# Altium schematic sheet MC2.SchDoc: XEM7360 Breakout Board - MC2
size C; Author: Nick Kettman; Organization: Opal Kelly; Address1: 13500 SW 72nd Ave Ste 100; Address2: Portland, OR 97223; Address4: http://www.opalkelly.com; DocumentNumber: xxx; Revision: 1; SheetNumber: 3; SheetTotal: 3; PageSetup: Record=PageOptions|CenterHorizontal=True|CenterVertical=True|PrintScale=0.53|XCorrection=1.00|YCorrection=1.00|PrintKind=0|BorderSize=5000000|LeftOffset=0|BottomOffset=0|Orientation=2|PaperLength=1000|PaperWidth=1000|Scale=100|PaperSource=7|PrintQuality=-4|MediaType=1|DitherType=10|PaperKind=Letter|PrintScaleMode=1
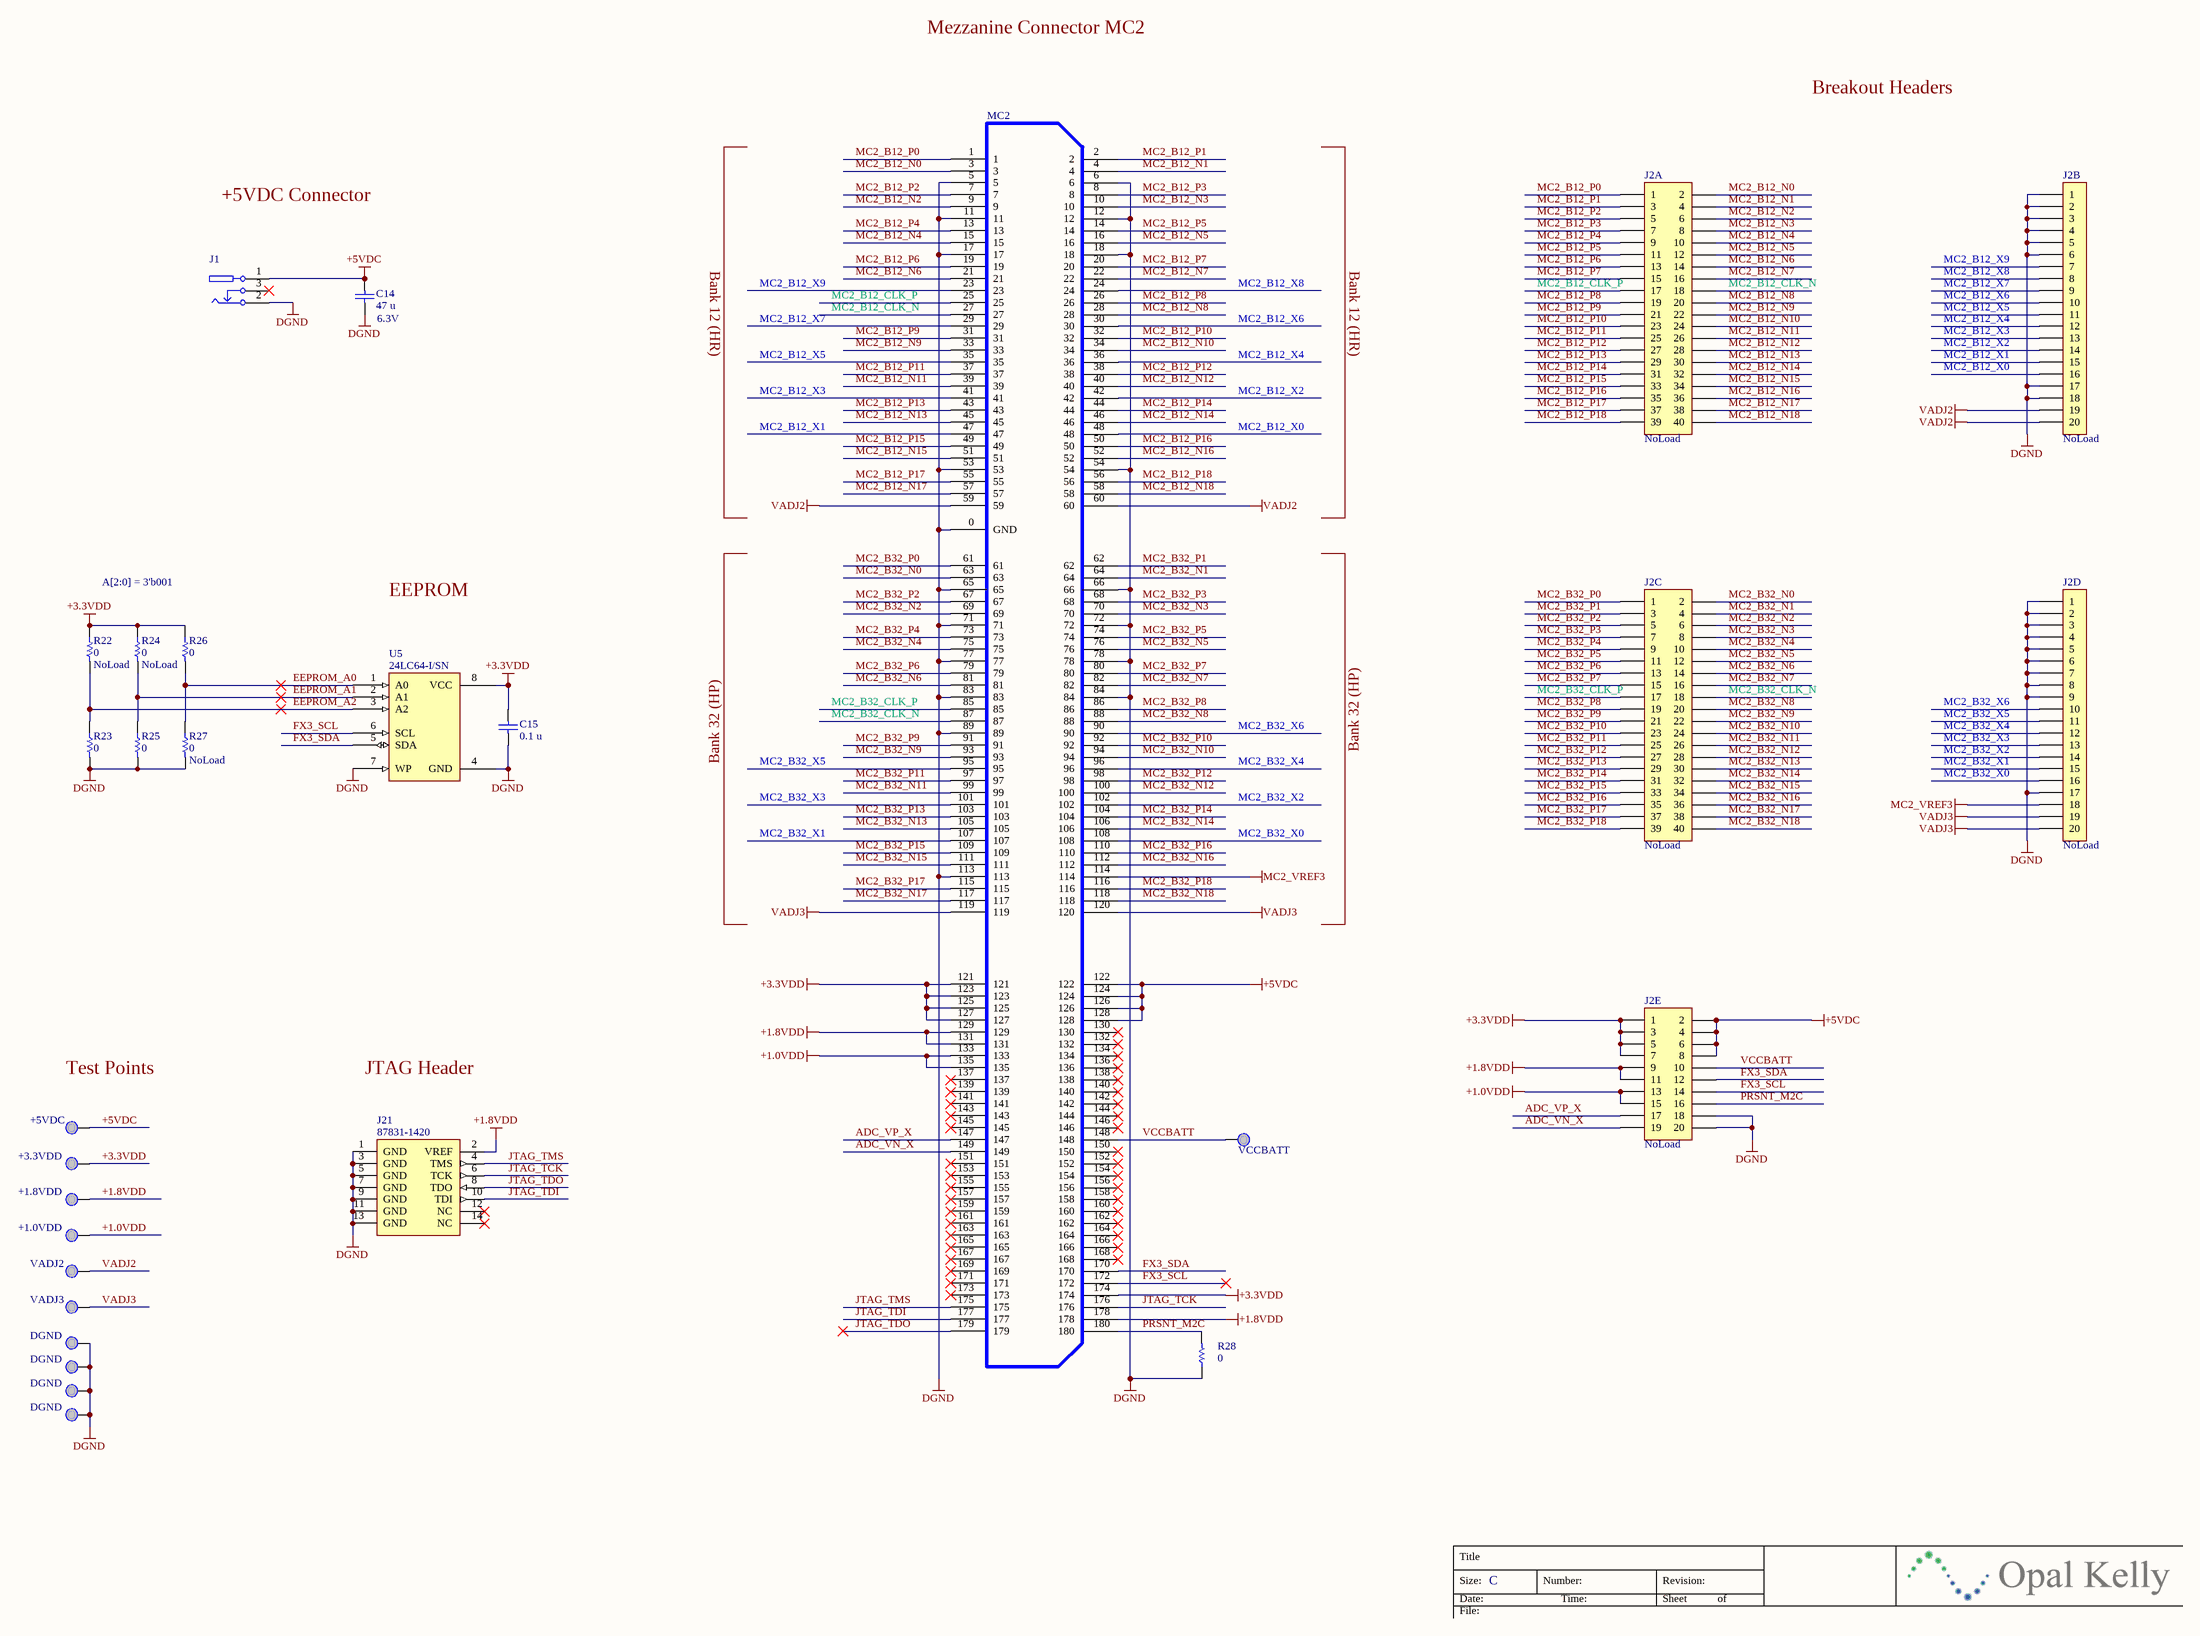
[diagram p0: MC2.SchDoc]

## Parts
C14  value 47 u  VoltageRating: 6.3V  [CAPC3216N]  (hidden comment: JMK316BJ476ML-T)
C15  value 0.1 u  [CAPC1005N]  (hidden comment: C0402C104K8PACTU)
J1  PJ-102AH  [CUI-PJ102A]  (value not drawn)
J2A  0877584016  [HDR2X20-2MM]  (value not drawn)
J2B  Header, 20-Pin, Single Row  [HDR1X20-2MM]  (value not drawn)
J2C  0877584016  [HDR2X20-2MM]  (value not drawn)
J2D  Header, 20-Pin, Single Row  [HDR1X20-2MM]  (value not drawn)
J2E  0877582016  [HDR2X10-2MM]  (value not drawn)
J21  87831-1420  [HDR2X7-2MM]
MC2  QTH-090-01-F-D-A  [QTH-090-01-X-D]  (value not drawn)
R22  value 0  [RESC1005N]  (hidden comment: CRCW04020000Z0ED)
R23  value 0  [RESC1005N]  (hidden comment: CRCW04020000Z0ED)
R24  value 0  [RESC1005N]  (hidden comment: CRCW04020000Z0ED)
R25  value 0  [RESC1005N]  (hidden comment: CRCW04020000Z0ED)
R26  value 0  [RESC1005N]  (hidden comment: CRCW04020000Z0ED)
R27  value 0  [RESC1005N]  (hidden comment: CRCW04020000Z0ED)
R28  value 0  [RESC1608N]  (hidden comment: CRCW06030000Z0EA)
TP2  +5VDC  [TP_MED]
TP3  +3.3VDD  [TP_MED]
TP4  +1.8VDD  [TP_MED]
TP5  +1.0VDD  [TP_MED]
TP6  VCCBATT  [TP_MED]
TP9  VADJ2  [TP_MED]
TP10  VADJ3  [TP_MED]
TP11  DGND  [TP_MED]
TP12  DGND  [TP_MED]
TP13  DGND  [TP_MED]
TP14  DGND  [TP_MED]
U5  24LC64-I/SN  [SO-G8]

## Nets
+1.0VDD: J2E.13 J2E.15 MC2.133 MC2.135 TP5.1(PIN)
+1.8VDD: J2E.9 J2E.11 J21.2(VREF) MC2.129 MC2.131 MC2.178 TP4.1(PIN)
+3.3VDD: C15.1 J2E.1 J2E.3 J2E.5 J2E.7 MC2.121 MC2.123 MC2.125 MC2.127 MC2.174 R22.1 R24.1 R26.1 TP3.1(PIN) U5.8(VCC)
+5VDC: C14.1 J1.1 J2E.2 J2E.4 J2E.6 J2E.8 MC2.122 MC2.124 MC2.126 MC2.128 TP2.1(PIN)
DGND: C14.2 C15.2 J1.2 J2B.1 J2B.2 J2B.3 J2B.4 J2B.5 J2B.6 J2B.17 J2B.18 J2D.1 J2D.2 J2D.3 J2D.4 J2D.5 J2D.6 J2D.7 J2D.8 J2D.9 J2D.17 J2E.18 J2E.20 J21.1(GND) J21.3(GND) J21.5(GND) J21.7(GND) J21.9(GND) J21.11(GND) J21.13(GND) MC2.0(GND) MC2.5 MC2.6 MC2.11 MC2.12 MC2.17 MC2.18 MC2.53 MC2.54 MC2.65 MC2.66 MC2.71 MC2.72 MC2.77 MC2.78 MC2.83 MC2.84 MC2.89 MC2.113 R23.2 R25.2 R27.2 R28.1 TP11.1(PIN) TP12.1(PIN) TP13.1(PIN) TP14.1(PIN) U5.4(GND) U5.7(WP)
MC2_VREF3: J2D.18 MC2.114
VADJ2: J2B.19 J2B.20 MC2.59 MC2.60 TP9.1(PIN)
VADJ3: J2D.19 J2D.20 MC2.119 MC2.120 TP10.1(PIN)
ADC_VN_X: J2E.19 MC2.149
ADC_VP_X: J2E.17 MC2.147
EEPROM_A0: R26.2 R27.1 U5.1(A0)
EEPROM_A1: R24.2 R25.1 U5.2(A1)
EEPROM_A2: R22.2 R23.1 U5.3(A2)
FX3_SCL: J2E.14 MC2.172 U5.6(SCL)
FX3_SDA: J2E.12 MC2.170 U5.5(SDA)
JTAG_TCK: J21.6(TCK) MC2.176
JTAG_TDI: J21.10(TDI) MC2.177
JTAG_TDO: J21.8(TDO) MC2.179
JTAG_TMS: J21.4(TMS) MC2.175
MC2_B12_CLK_N: J2A.18 MC2.27
MC2_B12_CLK_P: J2A.17 MC2.25
MC2_B12_N0: J2A.2 MC2.3
MC2_B12_N1: J2A.4 MC2.4
MC2_B12_N2: J2A.6 MC2.9
MC2_B12_N3: J2A.8 MC2.10
MC2_B12_N4: J2A.10 MC2.15
MC2_B12_N5: J2A.12 MC2.16
MC2_B12_N6: J2A.14 MC2.21
MC2_B12_N7: J2A.16 MC2.22
MC2_B12_N8: J2A.20 MC2.28
MC2_B12_N9: J2A.22 MC2.33
MC2_B12_N10: J2A.24 MC2.34
MC2_B12_N11: J2A.26 MC2.39
MC2_B12_N12: J2A.28 MC2.40
MC2_B12_N13: J2A.30 MC2.45
MC2_B12_N14: J2A.32 MC2.46
MC2_B12_N15: J2A.34 MC2.51
MC2_B12_N16: J2A.36 MC2.52
MC2_B12_N17: J2A.38 MC2.57
MC2_B12_N18: J2A.40 MC2.58
MC2_B12_P0: J2A.1 MC2.1
MC2_B12_P1: J2A.3 MC2.2
MC2_B12_P2: J2A.5 MC2.7
MC2_B12_P3: J2A.7 MC2.8
MC2_B12_P4: J2A.9 MC2.13
MC2_B12_P5: J2A.11 MC2.14
MC2_B12_P6: J2A.13 MC2.19
MC2_B12_P7: J2A.15 MC2.20
MC2_B12_P8: J2A.19 MC2.26
MC2_B12_P9: J2A.21 MC2.31
MC2_B12_P10: J2A.23 MC2.32
MC2_B12_P11: J2A.25 MC2.37
MC2_B12_P12: J2A.27 MC2.38
MC2_B12_P13: J2A.29 MC2.43
MC2_B12_P14: J2A.31 MC2.44
MC2_B12_P15: J2A.33 MC2.49
MC2_B12_P16: J2A.35 MC2.50
MC2_B12_P17: J2A.37 MC2.55
MC2_B12_P18: J2A.39 MC2.56
MC2_B12_X0: J2B.16 MC2.48
MC2_B12_X1: J2B.15 MC2.47
MC2_B12_X2: J2B.14 MC2.42
MC2_B12_X3: J2B.13 MC2.41
MC2_B12_X4: J2B.12 MC2.36
MC2_B12_X5: J2B.11 MC2.35
MC2_B12_X6: J2B.10 MC2.30
MC2_B12_X7: J2B.9 MC2.29
MC2_B12_X8: J2B.8 MC2.24
MC2_B12_X9: J2B.7 MC2.23
MC2_B32_CLK_N: J2C.18 MC2.87
MC2_B32_CLK_P: J2C.17 MC2.85
MC2_B32_N0: J2C.2 MC2.63
MC2_B32_N1: J2C.4 MC2.64
MC2_B32_N2: J2C.6 MC2.69
MC2_B32_N3: J2C.8 MC2.70
MC2_B32_N4: J2C.10 MC2.75
MC2_B32_N5: J2C.12 MC2.76
MC2_B32_N6: J2C.14 MC2.81
MC2_B32_N7: J2C.16 MC2.82
MC2_B32_N8: J2C.20 MC2.88
MC2_B32_N9: J2C.22 MC2.93
MC2_B32_N10: J2C.24 MC2.94
MC2_B32_N11: J2C.26 MC2.99
MC2_B32_N12: J2C.28 MC2.100
MC2_B32_N13: J2C.30 MC2.105
MC2_B32_N14: J2C.32 MC2.106
MC2_B32_N15: J2C.34 MC2.111
MC2_B32_N16: J2C.36 MC2.112
MC2_B32_N17: J2C.38 MC2.117
MC2_B32_N18: J2C.40 MC2.118
MC2_B32_P0: J2C.1 MC2.61
MC2_B32_P1: J2C.3 MC2.62
MC2_B32_P2: J2C.5 MC2.67
MC2_B32_P3: J2C.7 MC2.68
MC2_B32_P4: J2C.9 MC2.73
MC2_B32_P5: J2C.11 MC2.74
MC2_B32_P6: J2C.13 MC2.79
MC2_B32_P7: J2C.15 MC2.80
MC2_B32_P8: J2C.19 MC2.86
MC2_B32_P9: J2C.21 MC2.91
MC2_B32_P10: J2C.23 MC2.92
MC2_B32_P11: J2C.25 MC2.97
MC2_B32_P12: J2C.27 MC2.98
MC2_B32_P13: J2C.29 MC2.103
MC2_B32_P14: J2C.31 MC2.104
MC2_B32_P15: J2C.33 MC2.109
MC2_B32_P16: J2C.35 MC2.110
MC2_B32_P17: J2C.37 MC2.115
MC2_B32_P18: J2C.39 MC2.116
MC2_B32_X0: J2D.16 MC2.108
MC2_B32_X1: J2D.15 MC2.107
MC2_B32_X2: J2D.14 MC2.102
MC2_B32_X3: J2D.13 MC2.101
MC2_B32_X4: J2D.12 MC2.96
MC2_B32_X5: J2D.11 MC2.95
MC2_B32_X6: J2D.10 MC2.90
PRSNT_M2C: J2E.16 MC2.180 R28.2
VCCBATT: J2E.10 MC2.148 TP6.1(PIN)

Not connected (* = marked no-connect by the designer): J1 3*; J21 12(NC)* 14(NC)*; MC2 130* 132* 134* 136* 137* 138* 139* 140* 141* 142* 143* 144* 145* 146* 150* 151* 152* 153* 154* 155* 156* 157* 158* 159* 160* 161* 162* 163* 164* 165* 166* 167* 168* 169* 171* 173*

## Notes on the sheet
- Mezzanine Connector MC2
- Breakout Headers
- +5VDC Connector
- Bank 12 (HR)
- A[2:0] = 3'b001
- EEPROM
- Bank 32 (HP)
- Test Points
- JTAG Header
- Title
- Size:
- Date:
- File:
- C
- Number:
- Time:
- Revision:
- Sheet
- of

## Library data of the parts
C14 = 000570: Ceramic Capacitor; Manufacturer: Taiyo Yuden; partnumber: 000570; Description 2: 1206, 6.3V; ValueFloat: 4.7E-5; Tolerance (%): 20; Manufacturer_PN: JMK316BJ476ML-T; updated_on: 7/24/2015 11:01:17 AM
C15 = 000070: Ceramic capacitor; Manufacturer: Kemet; partnumber: 000070; Description 2: SM-0402, 10%, 10v; ValueFloat: 1E-7; Tolerance (%): 10; Manufacturer_PN: C0402C104K8PACTU; updated_on: 8/6/2015 11:41:11 AM
J1 = 000356: DC power connector - high current; Manufacturer: CUI Inc.; partnumber: 000356; Description 2: 2.1mm / 5.5mm; Manufacturer_PN: PJ-102AH; updated_on: 2/12/2015 4:53:15 PM
J2A J2C = 000583: 2mm header, 20x2, thru-hole; Manufacturer: Molex; partnumber: 000583; Manufacturer_PN: 0877584016; updated_on: 1/24/2015 12:30:40 PM; NoLoad: NoLoad
J2B J2D = 001334: 2mm header, 20x1, thru-hole; PartNumber: 001334; Manufacturer: 3M; Manufacturer_PN: 951120-8622-AR; x_lifecycle_status: Production; updated_on: 8/19/2015 3:11:41 PM; NoLoad: NoLoad
J2E = 001338: 2mm header, 10x2, thru-hole; Manufacturer: Molex; partnumber: 001338; Manufacturer_PN: 0877582016; updated_on: 8/25/2015 11:37:01 AM; NoLoad: NoLoad
J21 = 000541: 2mm header, shrouded; Manufacturer: Molex; partnumber: 000541; Description 2: Dual-row, 14-pos, Xilinx JTAG compatible; Manufacturer_PN: 87831-1420; updated_on: 7/22/2015 1:38:47 PM
MC2 = 000876: 0.5mm hi-speed, high-density header (Female); Manufacturer: Samtec; partnumber: 000876; Description 2: 180-pin, ground plane in middle; Manufacturer_PN: QTH-090-01-F-D-A; updated_on: 3/23/2015 1:16:30 PM
R22-R27 = 000755: Thick-film resistor; Manufacturer: Vishay; partnumber: 000755; Description 2: SM-0402, 1%, 1/16W; Tolerance (%): 1; Manufacturer_PN: CRCW04020000Z0ED; ValueFloat: 0
  R22 R24 R27: updated_on: 10/13/2015 2:32:19 PM; NoLoad: NoLoad
  R23 R25 R26: updated_on: 7/7/2015 8:21:48 AM
R28 = 000411: Zero-ohm resistor; Manufacturer: Vishay; partnumber: 000411; Description 2: SM-0603, 1/10W, 20 mOhm max; Manufacturer_PN: CRCW06030000Z0EA; ValueFloat: 0; updated_on: 2/12/2015 9:26:27 AM
TP2-TP6 TP9-TP14 = 000265: Testpoint; Manufacturer: Keystone Electronics; Manufacturer_PN: 5007; partnumber: 000265; Description 2: 0.063 in. diameter, compact, White; updated_on: 1/24/2015 12:30:04 PM; NoLoad: NoLoad
U5 = 000004: EEPROM; Manufacturer: Microchip; partnumber: 000004; Description 2: I2C, 8 kByte; Manufacturer_PN: 24LC64-I/SN; updated_on: 1/24/2015 12:29:45 PM